# Altium schematic sheet TI_FREQ.SchDoc
size A4
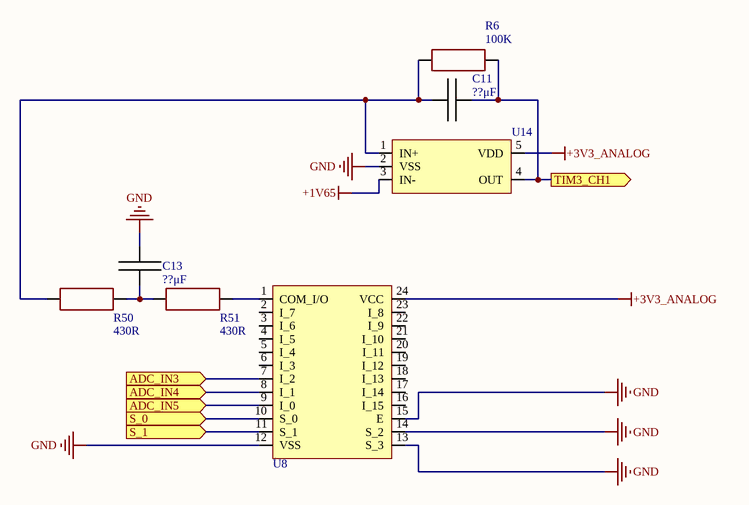
[diagram p0: TI_FREQ.SchDoc]

## Parts
C11  value ??μF  [CAP: 0603]  (hidden comment: Cap_0603)
C13  value ??μF  [CAP: 0603]  (hidden comment: Cap_0603)
R6  value 100K  [RES: 0603]  (hidden comment: Resistor_0603)
R50  value 430R  [RES: 0603]  (hidden comment: Resistor_0603)
R51  value 430R  [RES: 0603]  (hidden comment: Resistor_0603)
U8  CD74HC4067M96  [SOIC-24]  (value not drawn)
U14  MCP6001U  [SOT-23-5]  (value not drawn)

## Ports
ADC_IN3 (in), ADC_IN4 (in), ADC_IN5 (in), S_0 (in), S_1 (in), TIM3_CH1 (out)

## Nets
+1V65: U14.3(IN-)
+3V3_ANALOG: U8.24(VCC) U14.5(VDD)
GND: C13.2 U8.12(VSS) U8.13(S_3) U8.14(S_2) U8.15(E) U14.2(VSS)
ADC_IN3: U8.7(I_2) ; port ADC_IN3
ADC_IN4: U8.8(I_1) ; port ADC_IN4
ADC_IN5: U8.9(I_0) ; port ADC_IN5
S_0: U8.10(S_0) ; port S_0
S_1: U8.11(S_1) ; port S_1
TIM3_CH1: C11.2 R6.1 U14.4(OUT) ; port TIM3_CH1
NetC11_1: C11.1 R6.2 R50.1 U14.1(IN+)
NetC13_1: C13.1 R50.2 R51.1
NetR51_2: R51.2 U8.1(COM_I/O)

Not connected (* = marked no-connect by the designer): U8 2(I_7) 3(I_6) 4(I_5) 5(I_4) 6(I_3) 16(I_15) 17(I_14) 18(I_13) 19(I_12) 20(I_11) 21(I_10) 22(I_9) 23(I_8)

## Library data of the parts
C11 C13 = Cap_0603: TypeDielectric: X7R(X5R); Voltage: ??V; Package/Case: 0603; Temperature: -55...+125°C(-55...+85°C); Product Category: Capacitors
R6 R50 R51 = Resistor_0603: Power: 0.1W; Tolerance: ±5%; Package/Case: 0603; Temperature: -55...+125°C; Product Category: Resistors
U8 = CD74HC4067M96: 1 MHz, Low-Power Op Amp; Manufacturer: Texas Instruments; Datasheet: https://www.ti.com/general/docs/suppproductinfo.tsp?distId=26&gotoUrl=https://www.ti.com/lit/gpn/cd74hct4067; HelpURL: https://eu.mouser.com/ProductDetail/Texas-Instruments/CD74HC4067M96?qs=xFfolx0DHx0XT7d9xTTZBA%3D%3D; Package/Case: SOIC-24; Product Category: Multiplexers
U14 = MCP6001U: 1 MHz, Low-Power Op Amp; Manufacturer: Microchip; Datasheet: https://eu.mouser.com/ProductDetail/Microchip-Technology-Atmel/MCP6004-I-SL?qs=n%2FfJlMG9rCZ2%2F%2FCryvZ52w%3D%3D; HelpURL: https://eu.mouser.com/ProductDetail/Microchip-Technology-Atmel/MCP6001UT-I-OT?qs=Sez7gRs8XSU2iw24kVuIOw%3D%3D; Package/Case: SOT-23-5; Product Category: Operational Amplifiers